# EAGLE design GPS_Shield-v10 (EAGLE 6.2)
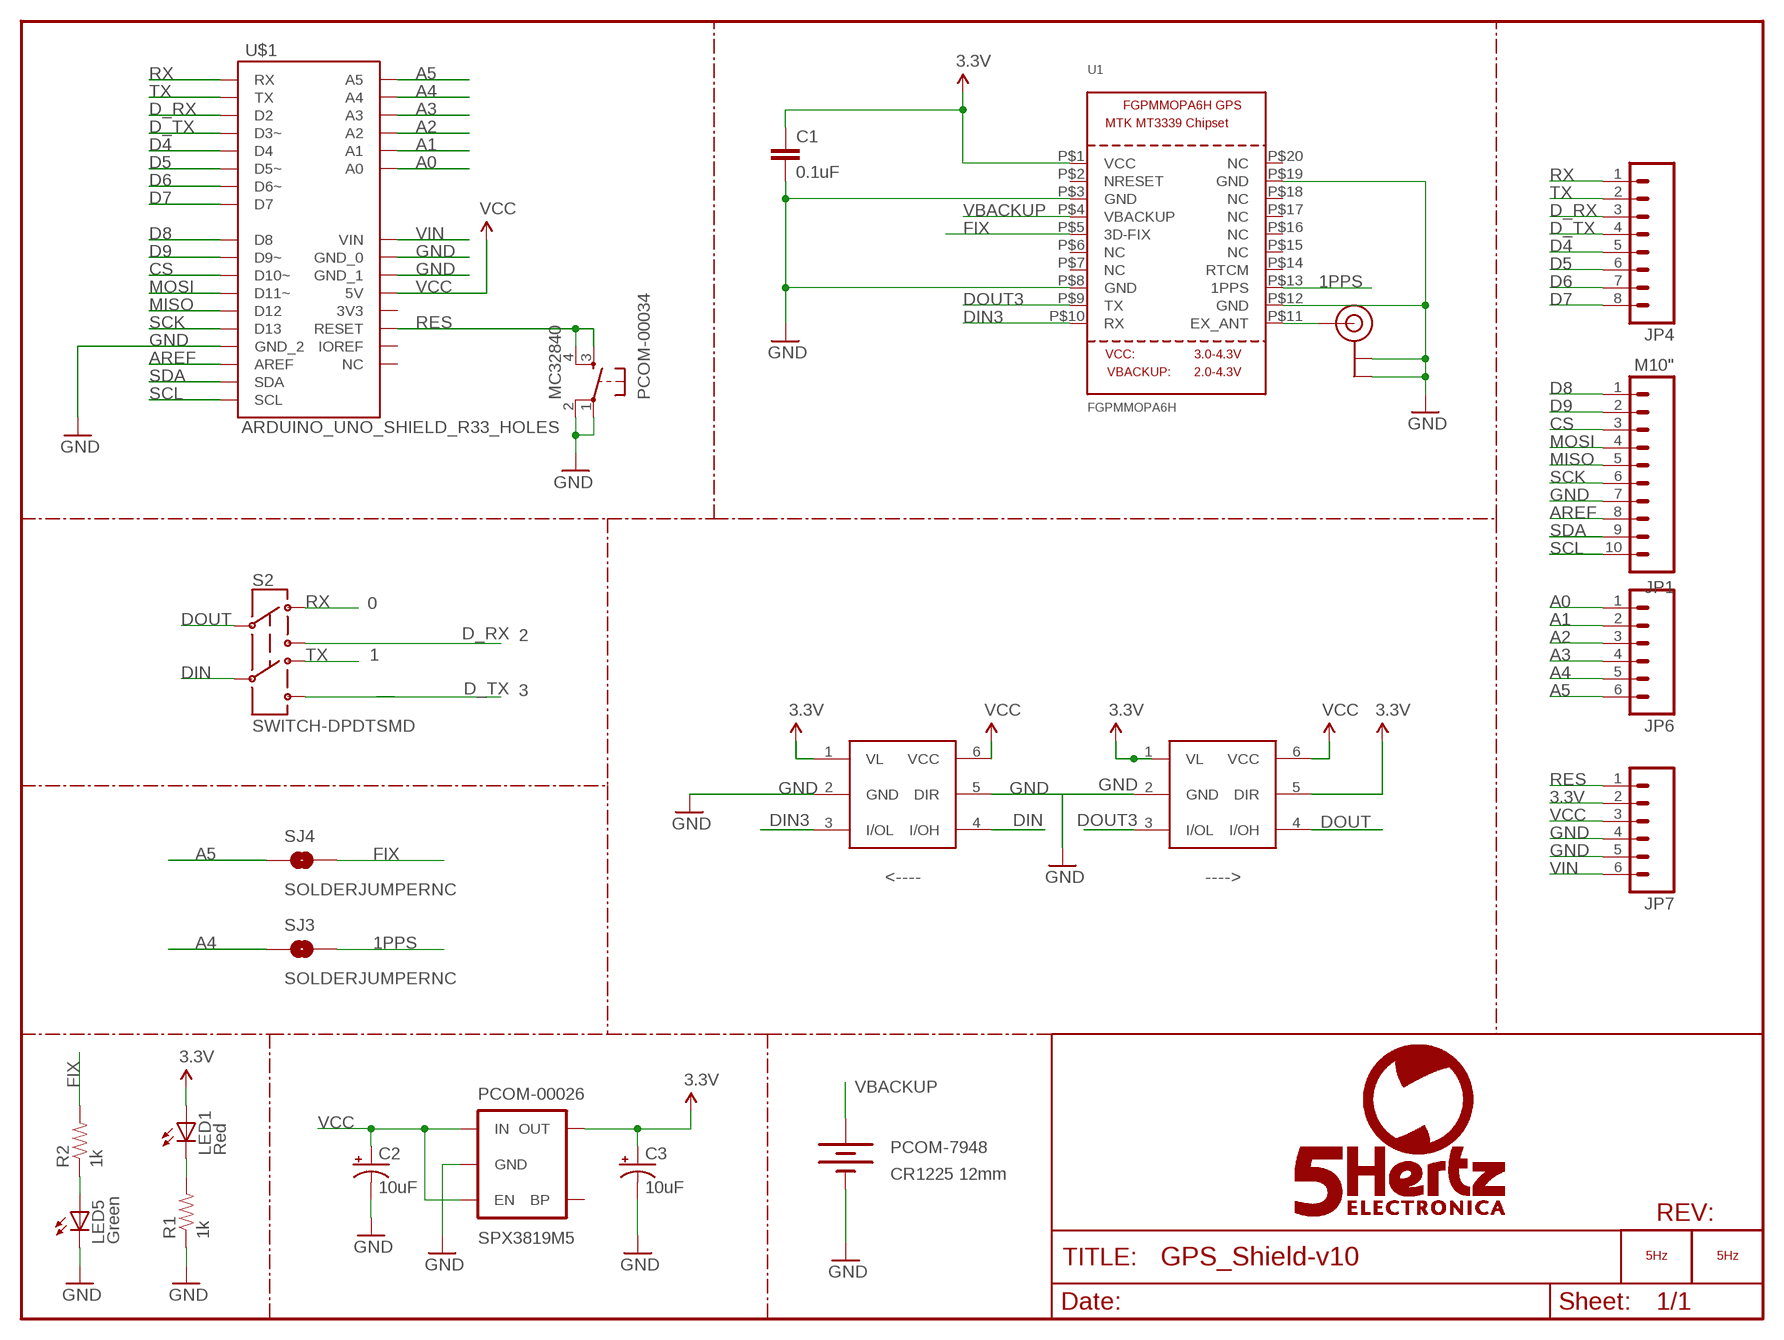
[diagram p0: schematic, sheet 1]

## Parts
C1  0.1uF  CAP0603-CAP  [0603-CAP]
C2  10uF  CAP_POL1206  [EIA3216]
C3  10uF  CAP_POL1206  [EIA3216]
JP1  M10"  [1X10]
JP4  M08  [1X08]
JP6  M06SIP  [1X06]
JP7  M06SIP  [1X06]
LED1  Red  LED0603  [LED-0603]
LED5  Green  LED0603  [LED-0603]
LOGO1  LOGO_5HZ_H_COOPER_15MM  [5HZ_LOGO_H_COOPER_15MM]
LOGO2  LOGO_5HZ_H_20MM  [5HZ_LOGO_H_20MM]
PCOM-00026  SPX3819M5  V_REG_LDOSMD  [SOT23-5]
PCOM-00034  MC32840  TAC_SWITCHSMD  [TACTILE_SWITCH_SMD]
PCOM-7948  CR1225 12mm  BATTERY12PTH  [BATTCON_12MM_PTH]
R1  1k  RESISTOR0603-RES  [0603-RES]
R2  1k  RESISTOR0603-RES  [0603-RES]
S2  SWITCH-DPDTSMD  [AYZ0202]
SJ3  SOLDERJUMPERNC  [SJ_2S]
SJ4  SOLDERJUMPERNC  [SJ_2S]
U1  FGPMMOPA6H  GPS_FGPMMOPA6H  [FGPMMOPA6H]
U$1  ARDUINO_UNO_SHIELD_R33_HOLES  [UNO_R3_SHIELD_3_HOLES_NO_SILK]
U$7  MAX337  [SOT-363]
U$8  MAX337  [SOT-363]
U$20  U.FL  [U.FL]

## Nets
1PPS: SJ3.2 U1.P$13(1PPS)
3.3V: C1.1 C3.A(+) JP7.2 LED1.A PCOM-00026.5(OUT) U1.P$1(VCC) U$7.1(VL) U$8.1(VL) U$8.5(DIR)
A0: JP6.1 U$1.A0
A1: JP6.2 U$1.A1
A2: JP6.3 U$1.A2
A3: JP6.4 U$1.A3
A4: JP6.5 SJ3.1 U$1.A4
A5: JP6.6 SJ4.1 U$1.A5
AREF: JP1.8 U$1.AREF
CS: JP1.3 U$1.D10(D10~)
D4: JP4.5 U$1.D4
D5: JP4.6 U$1.D5(D5~)
D6: JP4.7 U$1.D6(D6~)
D7: JP4.8 U$1.D7
D8: JP1.1 U$1.D8
D9: JP1.2 U$1.D9(D9~)
D_RX: JP4.3 S2.3 U$1.D2
D_TX: JP4.4 S2.6 U$1.D3(D3~)
DIN: S2.5 U$7.4(I/OH)
DIN3: U1.P$10(RX) U$7.3(I/OL)
DOUT: S2.2 U$8.4(I/OH)
DOUT3: U1.P$9(TX) U$8.3(I/OL)
FIX: R2.2 SJ4.2 U1.P$5(3D-FIX)
GND: C1.2 C2.C(-) C3.C(-) JP1.7 JP7.4 JP7.5 LED5.C PCOM-00026.2(GND) PCOM-00034.1 PCOM-00034.2 PCOM-7948.GND(-) R1.1 U1.P$3(GND) U1.P$8(GND) U1.P$12(GND) U1.P$19(GND) U$1.GND_0 U$1.GND_1 U$1.GND_2 U$7.2(GND) U$7.5(DIR) U$8.2(GND) U$20.P$1(GND) U$20.P$2(GND)
MISO: JP1.5 U$1.D12
MOSI: JP1.4 U$1.D11(D11~)
N$6: LED1.C R1.2
N$7: U1.P$11(EX_ANT) U$20.P$3(SIGNAL)
N$139: LED5.A R2.1
RES: JP7.1 PCOM-00034.3 PCOM-00034.4 U$1.RES(RESET)
RX: JP4.1 S2.1 U$1.RX
SCK: JP1.6 U$1.D13
SCL: JP1.10 U$1.SCL
SDA: JP1.9 U$1.SDA
TX: JP4.2 S2.4 U$1.TX
VBACKUP: PCOM-7948.VCC@1(+) U1.P$4(VBACKUP)
VCC: C2.A(+) JP7.3 PCOM-00026.1(IN) PCOM-00026.3(EN) U$1.5V U$7.6(VCC) U$8.6(VCC)
VIN: JP7.6 U$1.VIN
Unconnected: PCOM-00026.4(BP) U1.P$2(NRESET) U1.P$6(NC) U1.P$7(NC) U1.P$14(RTCM) U1.P$15(NC) U1.P$16(NC) U1.P$17(NC) U1.P$18(NC) U1.P$20(NC) U$1.3.3V(3V3) U$1.IOREF U$1.NC

## Notes on the sheet
- 0
- 2
- 1
- 3
- <---- | ---->

## Library data of the parts
C1 = 5hz-electronica:CAP: Capacitor Standard 0603 ceramic capacitor, and 0.1" leaded capacitor.
C2 C3 = SparkFun:CAP_POL: Capacitor Polarized These are standard SMD and PTH capacitors. Normally 10uF, 47uF, and 100uF in electrolytic and tantalum varieties. Always verify the external diameter of the through hole cap, it varies with capacity, voltage, and manufacturer. The EIA devices should be standard.
JP1 = SparkFun:M10: Header 10 Standard 10-pin 0.1" header. Use with straight break away headers (SKU : PRT-00116), right angle break away headers (PRT-00553), swiss pins (PRT-00743), machine pins (PRT-00117), and female headers (PRT-00115).
JP4 = SparkFun:M08: Header 8 Standard 8-pin 0.1" header. Use with straight break away headers (SKU : PRT-00116), right angle break away headers (PRT-00553), swiss pins (PRT-00743), machine pins (PRT-00117), and female headers (PRT-00115).
JP6 JP7 = SparkFun:M06: Header 6 Standard 6-pin 0.1" header. Use with straight break away headers (SKU : PRT-00116), right angle break away headers (PRT-00553), swiss pins (PRT-00743), machine pins (PRT-00117), and female headers (PRT-00115). Molex polarized connector foot print use with SKU : PRT-08094 with associated crimp pins and housings. NOTES ON THE VARIANTS LOCK and LOCK_LONGPADS... This footprint was designed to help hold the alignment of a through-hole component (i.e. 6-pin header) while soldering it into place. You may notice that each hole has been shifted either up or down by 0.005 of an inch from it's more standard position (which is a perfectly straight line). This slight alteration caused the pins (the squares in the middle) to touch the edges of the holes. Because they are alternating, it causes a "brace" to hold the component in place. 0.005 has proven to be the perfect amount of "off-center" position when using our standard breakaway headers. Although looks a little odd when you look at the bare footprint, once you have a header in there, the alteration is very hard to notice. Also, if you push a header all the way into place, it is covered up entirely on the bottom side. This idea of altering the position of holes to aid alignment will be further integrated into the Sparkfun Library for other footprints. It can help hold any component with 3 or more connection pins.
LED1 LED5 = SparkFun:LED: LEDs Standard schematic elements and footprints for 5mm, 3mm, 1206, and 0603 sized LEDs. 5mm - Spark Fun Electronics SKU : COM-00529 (and others)
LOGO1 LOGO2 = 5hz-electronica:LOGO_5HZ: Logotipo 5Hz "según Pedro"
PCOM-00026 = SparkFun:V_REG_LDO: Voltage Regulator LDO Standard 150mA LDO voltage regulator in SOT-23 layout. Micrel part MIC5205. BP (by-pass) pin is used to lower output noise with 470pF cap.
PCOM-00034 = SparkFun:TAC_SWITCH: Momentary Switch Button commonly used for reset or general input. Spark Fun Electronics SKU : COM-00097
PCOM-7948 = SparkFun:BATTERY: Battery Holders Various common sizes : AA, AAA, 20mm coin cell and 12mm coin cell.
R1 R2 = SparkFun:RESISTOR: Resistor Basic schematic elements and footprints for 0603, 1206, and PTH resistors.
S2 = SparkFun:SWITCH-DPDT: DPDT Version of the COM-00597
SJ3 SJ4 = SparkFun:SOLDERJUMPER: Solder Jumper Standard SMD solder jumper. Used to automate production. Two varients : Normally Open and Normally Closed are the same, but have different paste layers. NC will have a large amount of paste and should jumper during reflow.
U1 = microbuilder:GPS_FGPMMOPA6H: GPS Module - MTK MT3339 Chipset, -165dBm sensitivity, 22 channels, 10Hz, auto-select external antenna options
U$1 = 5hz-electronica:ARDUINO_UNO_SHIELD_R3
U$7 U$8 = 74LVCH1T45:MAX337
U$20 = microbuilder:U.FL: U.FL Antenna Connector

## Board
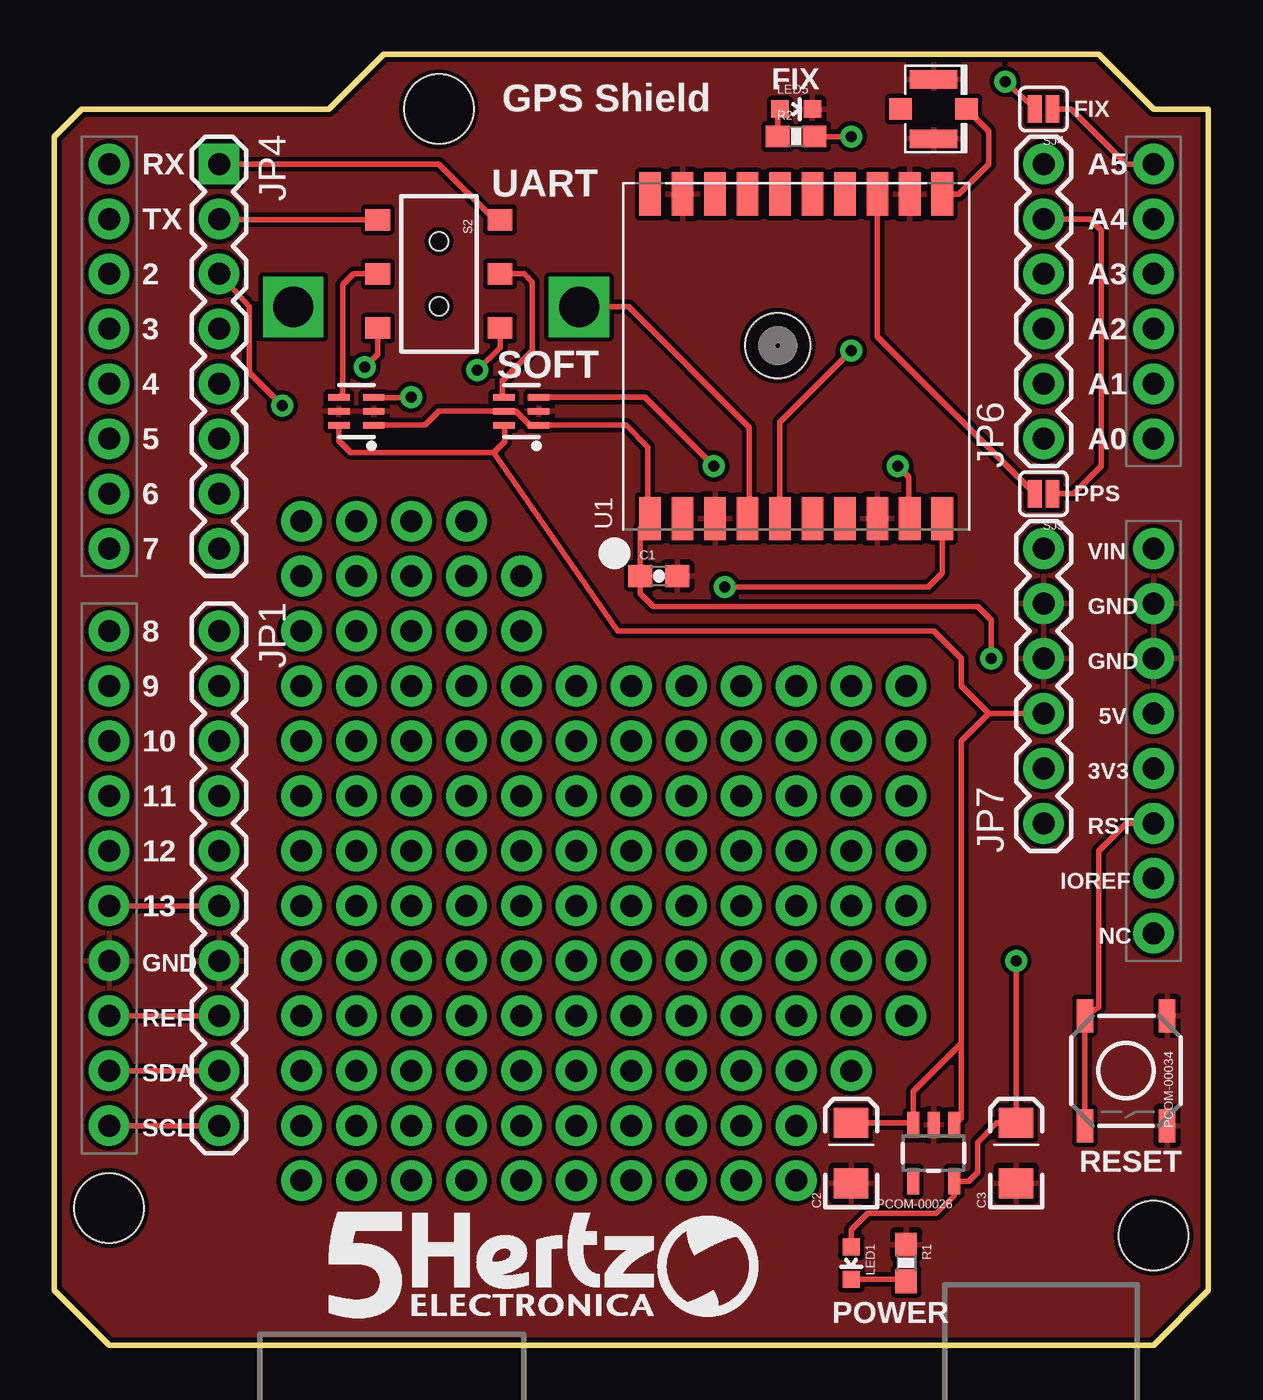
[diagram p1: board, top side]
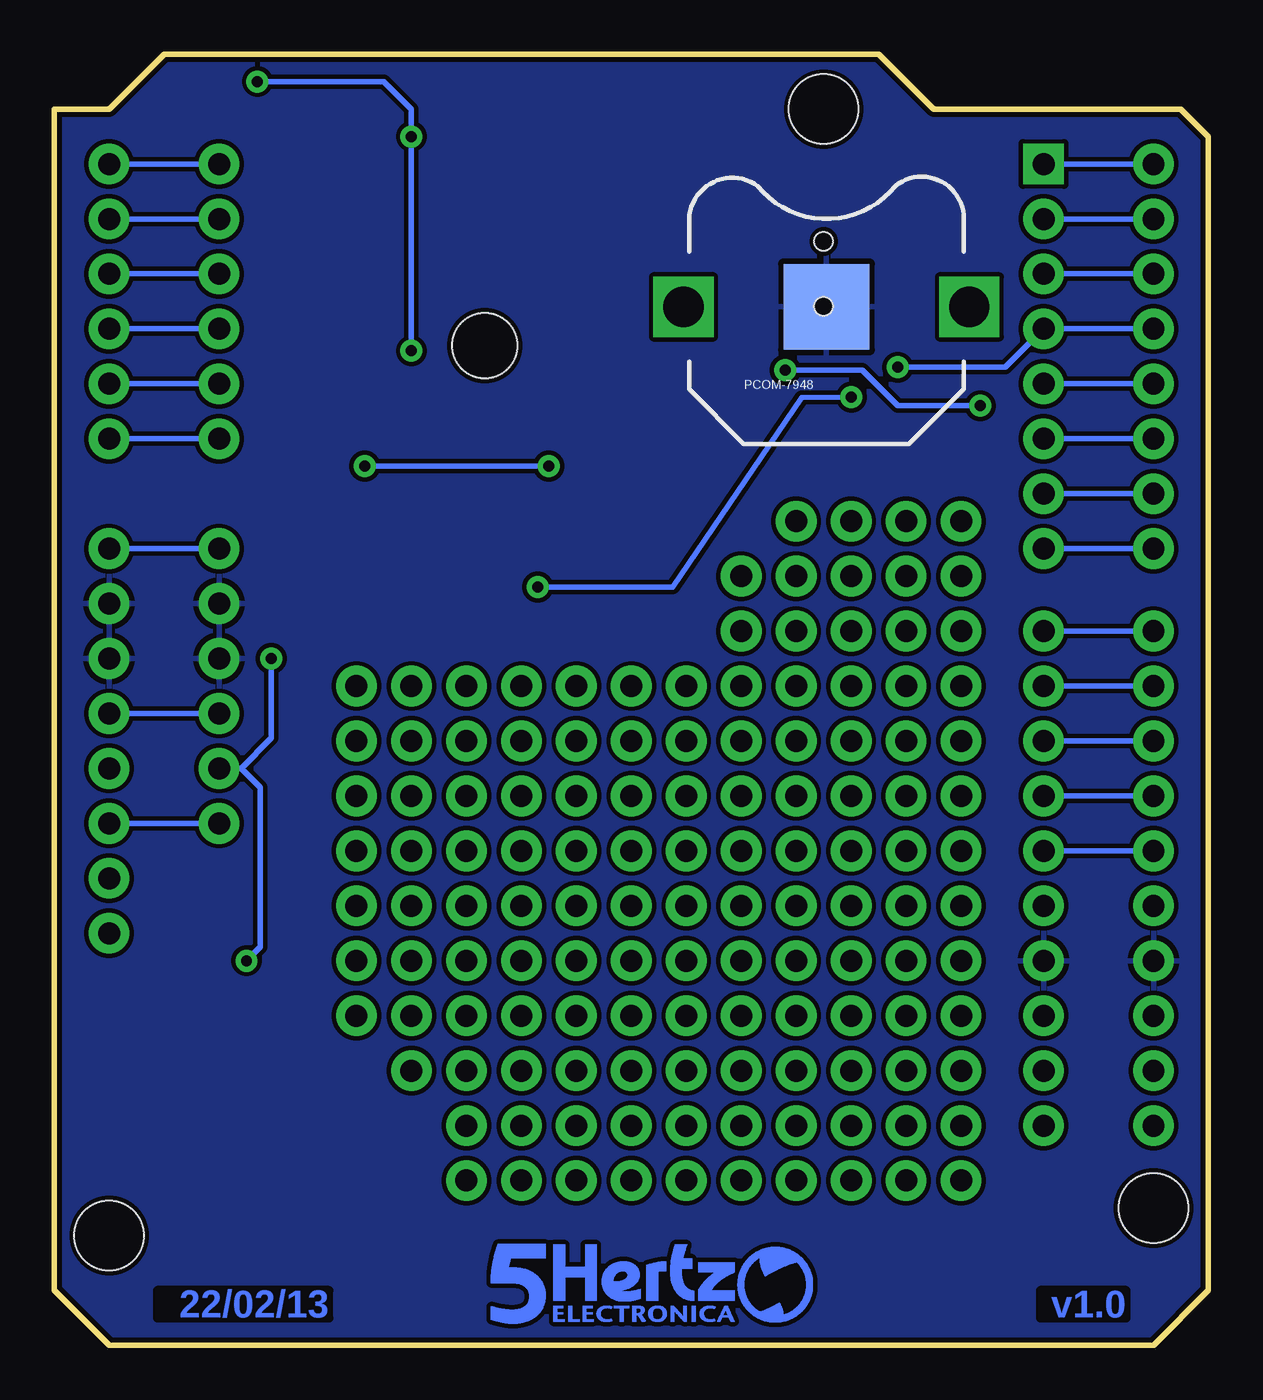
[diagram p2: board, bottom side, seen from below]

Size 53.34 x 59.69 mm. Coordinates in mm from the lower left corner, seen from the top.
Outline: 0,2.54 0,55.88 1.27,57.15 12.7,57.15 15.24,59.69 48.26,59.69 50.8,57.15 53.34,57.15 53.34,2.54 50.8,0 2.54,0 0,2.54
Copper layers (1*16): Top 0.035mm / dielectric 1.5mm / Bottom 0.035mm
Design rules: minimum track width 8mil, minimum drill 20mil, track to track 8mil, track to pad 8mil, pad to pad 8mil, via to via 8mil, smd to smd 8mil, copper to edge 9mil, drill to drill 8mil, minimum pad ring 12mil, minimum via ring 10mil, stop-mask expansion 4mil, vias tented up to drill 20mil, thermal gap 10mil

### Footprints (pad centres in the part's own frame; a part is rotated, then mirrored left to right if it is on the bottom)
0603-CAP = smd 1.1 x 1: 1 -0.85,0; 2 0.85,0
EIA3216 = smd 1.4 x 1.6: A 1.4,0; C -1.4,0
1X10 = drill 1.016 pad 1.88: 1 0,0; 2 2.54,0; 3 5.08,0; 4 7.62,0; 5 10.16,0; 6 12.7,0; 7 15.24,0; 8 17.78,0; 9 20.32,0; 10 22.86,0
1X08 = drill 1.016 pad 1.88 square: 1 0,0 | drill 1.016 pad 1.88: 2 2.54,0; 3 5.08,0; 4 7.62,0; 5 10.16,0; 6 12.7,0; 7 15.24,0; 8 17.78,0
1X06 = drill 1.016 pad 1.88: 1 0,0; 2 2.54,0; 3 5.08,0; 4 7.62,0; 5 10.16,0; 6 12.7,0
LED-0603 = smd 0.8 x 0.8: A 0,-0.75; C 0,0.75
SOT23-5 = smd 0.55 x 1.2: 1 -0.95,-1.3; 2 0,-1.3; 3 0.95,-1.3; 4 0.95,1.3; 5 -0.95,1.3
TACTILE_SWITCH_SMD = smd 1.524 x 0.762: 1 -2.54,1.905; 2 2.54,1.905; 3 -2.54,-1.905; 4 2.54,-1.905
BATTCON_12MM_PTH = smd 3.962 x 3.962: GND 0,0 | drill 1.854 square: VCC@1 -6.604,0; VCC@2 6.604,0
0603-RES = smd 1.1 x 1: 1 -0.85,0; 2 0.85,0
AYZ0202 = smd 1 x 1.15: 1 -2.5,2.825; 2 0,2.825; 3 2.5,2.825; 4 -2.5,-2.825; 5 0,-2.825; 6 2.5,-2.825 | hole 0.85: 1.5,0; -1.5,0
SJ_2S = smd 0.635 x 1.27: 1 -0.412,0; 2 0.412,0
FGPMMOPA6H = smd 2 x 1: P$1 -7.5,6.75; P$2 -7.5,5.25; P$3 -7.5,3.75; P$4 -7.5,2.25; P$5 -7.5,0.75; P$6 -7.5,-0.75; P$7 -7.5,-2.25; P$8 -7.5,-3.75; P$9 -7.5,-5.25; P$10 -7.5,-6.75; P$11 7.5,-6.75; P$12 7.5,-5.25; P$13 7.5,-3.75; P$14 7.5,-2.25; P$15 7.5,-0.75; P$16 7.5,0.75; P$17 7.5,2.25; P$18 7.5,3.75; P$19 7.5,5.25; P$20 7.5,6.75 | hole 3: 0.5,0.85
UNO_R3_SHIELD_3_HOLES_NO_SILK = drill 1.016 pad 1.88: 3.3V 26.67,2.54; 5V 29.21,2.54; A0 41.91,2.54; A1 44.45,2.54; A2 46.99,2.54; A3 49.53,2.54; A4 52.07,2.54; A5 54.61,2.54; AREF 15.24,50.8; D2 49.53,50.8; D3 46.99,50.8; D4 44.45,50.8; D5 41.91,50.8; D6 39.37,50.8; D7 36.83,50.8; D8 33.02,50.8; D9 30.48,50.8; D10 27.94,50.8; D11 25.4,50.8; D12 22.86,50.8; D13 20.32,50.8; GND_0 34.29,2.54; GND_1 31.75,2.54; GND_2 17.78,50.8; IOREF 21.59,2.54; NC 19.05,2.54; RES 24.13,2.54; RX 54.61,50.8; SCL 10.16,50.8; SDA 12.7,50.8; TX 52.07,50.8; VIN 36.83,2.54 | hole 3.2: 6.35,50.8; 5.08,2.54; 57.15,35.56
SOT-363 = smd 0.3 x 0.99: 1 -0.65,-0.8; 2 0,-0.8; 3 0.65,-0.8; 4 0.65,0.81; 5 0,0.81; 6 -0.65,0.81
U.FL = smd 2.2 x 0.85: P$1 0,1.375; P$2 0,-1.375 | smd 1.05 x 1: P$3 1.525,0; P$4 -1.525,0

### Placement (x,y rotation side)
C1  27.94,35.56 0 top
C2  36.83,8.89 90 top
C3  44.45,8.89 90 top
JP1  7.62,33.02 270 top
JP4  7.62,54.61 270 top
JP6  45.72,41.91 90 top
JP7  45.72,24.13 90 top
LED1  36.83,3.81 180 top
LED5  34.29,57.15 270 top
LOGO1  33.15,1.02 0 bottom
LOGO2  12.7,1.27 0 top
PCOM-00026  40.64,8.89 180 top
PCOM-00034  49.53,12.7 270 top
PCOM-7948  17.65,48.01 0 bottom
R1  39.37,3.81 270 top
R2  34.29,55.88 0 top
S2  17.78,49.53 270 top
SJ3  45.72,39.37 180 top
SJ4  45.72,57.15 180 top
U1  34.29,45.72 90 top
U$1  53.34,0 90 top
U$7  13.97,43.18 90 top
U$8  21.59,43.18 90 top
U$20  40.64,57.15 0 top

### Tracks (layer width: path | path; a pad name or v marks a point on that pad's centre or on a via)
1PPS
  Top 0.254: U1.P$13 38.04,46.64 SJ3.2
3.3V  (via drill 0.51)
  Top 0.254: LED1.A 36.83,5.33 37.59,6.1 40.77,6.1 41.59,6.92 PCOM-00026.5 42.26,7.59 42.67,8 42.67,9.4 43.56,10.29 C3.A v44.45,17.78 | v43.31,31.75 43.31,33.53 42.67,34.16 27.69,34.16 27.09,34.76 C1.1 27.09,37.77 U1.P$1 27.43,38.33 27.43,41.53 26.43,42.53 U$8.1 21.99,42.53 21.34,43.18 U$8.5 17.78,43.18 17.13,42.53 U$7.1
  Bottom 0.254: JP7.2 44.7,26.67 | 44.7,26.67 43.82,25.78 43.82,18.41 v44.45,17.78 | v43.31,31.75 43.31,28.07 44.7,26.67
A0
  Bottom 0.254: JP6.1 U$1.A0
A1
  Bottom 0.254: JP6.2 U$1.A1
A2
  Bottom 0.254: JP6.3 U$1.A2
A3
  Bottom 0.254: JP6.4 U$1.A3
A4
  Top 0.254: SJ3.1 47.12,39.37 48.39,40.64 48.39,51.56 47.88,52.07 JP6.5
  Bottom 0.254: JP6.5 U$1.A4
A5
  Top 0.254: SJ4.1 46.99,57.15 49.53,54.61 U$1.A5
  Bottom 0.254: U$1.A5 JP6.6
AREF
  Top 0.254: U$1.AREF JP1.8
CS
  Bottom 0.254: U$1.D10 JP1.3
D4
  Bottom 0.254: U$1.D4 JP4.5
D5
  Bottom 0.254: U$1.D5 JP4.6
D6
  Bottom 0.254: U$1.D6 JP4.7
D7
  Bottom 0.254: U$1.D7 JP4.8
D8
  Bottom 0.254: U$1.D8 JP1.1
D9
  Bottom 0.254: U$1.D9 JP1.2
D_RX  (via drill 0.51)
  Top 0.254: S2.3 20.61,46.13 v19.56,45.09 | v10.54,43.43 9.02,44.96 9.02,48.01 JP4.3
  Bottom 0.254: U$1.D2 JP4.3 | v19.56,45.09 16,45.09 14.35,43.43 v10.54,43.43
D_TX  (via drill 0.51)
  Top 0.254: S2.6 14.96,45.82 v14.35,45.21
  Bottom 0.254: v14.35,45.21 9.4,45.21 JP4.4 U$1.D3
DIN
  Top 0.254: S2.5 13.84,49.53 13.33,49.02 13.33,44.01 U$7.4
DIN3  (via drill 0.51)
  Top 0.254: U1.P$10 41.04,35.71 40.39,35.05 v30.99,35.05 | U$7.3 14.79,43.81 16.51,43.81 v16.5,43.83
  Bottom 0.254: v30.99,35.05 24.77,35.05 18.8,43.81 16.78,43.83 v16.5,43.83
DOUT
  Top 0.254: S2.2 21.72,49.53 22.1,49.15 22.1,45.97 20.7,44.58 20.7,43.91 U$8.4
DOUT3  (via drill 0.51)
  Top 0.254: U$8.3 27.29,43.83 v30.48,40.64 | v38.99,40.64 39.5,40.13 39.5,38.26 U1.P$9
  Bottom 0.254: v30.48,40.64 v38.99,40.64
FIX  (via drill 0.51)
  Top 0.254: R2.2 v36.83,55.88 | U1.P$5 33.53,38.23 33.53,42.67 v36.83,45.97 | SJ4.2 45.31,57.18 v43.94,58.42
  Bottom 0.254: v36.83,45.97 v36.83,55.88 36.83,57.15 38.1,58.42 v43.94,58.42
GND
  pour Bottom: 2.54,0 0,2.54 0,55.88 1.27,57.15 12.7,57.15 15.24,59.69 48.26,59.69 50.8,57.15 53.34,57.15 53.34,2.54 50.8,0
  pour Top: 2.54,0 0,2.54 0,55.88 1.27,57.15 12.7,57.15 15.24,59.69 48.26,59.69 50.8,57.15 53.34,57.15 53.34,2.54 50.8,0
MISO
  Bottom 0.254: U$1.D12 JP1.5
MOSI
  Bottom 0.254: U$1.D11 JP1.4
N$1  (via drill 1.02 pad 1.88)
  other vias: 26.67,30.48
N$2  (via drill 1.02 pad 1.88)
  other vias: 11.43,25.4
N$3  (via drill 1.02 pad 1.88)
  other vias: 24.13,30.48
N$4  (via drill 1.02 pad 1.88)
  other vias: 11.43,22.86
N$5  (via drill 1.02 pad 1.88)
  other vias: 21.59,30.48
N$6
  Top 0.254: R1.2 39.37,3.17 39.26,3.06 LED1.C
N$7
  Top 0.254: U1.P$11 41.79,53.22 43.18,54.61 43.18,56.13 U$20.P$3
N$8  (via drill 1.02 pad 1.88)
  other vias: 21.59,22.86
N$9  (via drill 1.02 pad 1.88)
  other vias: 16.51,30.48
N$10  (via drill 1.02 pad 1.88)
  other vias: 16.51,27.94
N$11  (via drill 1.02 pad 1.88)
  other vias: 16.51,25.4
N$12  (via drill 1.02 pad 1.88)
  other vias: 16.51,22.86
N$13  (via drill 1.02 pad 1.88)
  other vias: 16.51,20.32
N$14  (via drill 1.02 pad 1.88)
  other vias: 19.05,20.32
N$15  (via drill 1.02 pad 1.88)
  other vias: 21.59,20.32
N$16  (via drill 1.02 pad 1.88)
  other vias: 24.13,20.32
N$17  (via drill 1.02 pad 1.88)
  other vias: 26.67,20.32
N$18  (via drill 1.02 pad 1.88)
  other vias: 29.21,20.32
N$19  (via drill 1.02 pad 1.88)
  other vias: 31.75,20.32
N$20  (via drill 1.02 pad 1.88)
  other vias: 34.29,20.32
N$21  (via drill 1.02 pad 1.88)
  other vias: 36.83,20.32
N$22  (via drill 1.02 pad 1.88)
  other vias: 36.83,22.86
N$23  (via drill 1.02 pad 1.88)
  other vias: 36.83,25.4
N$24  (via drill 1.02 pad 1.88)
  other vias: 36.83,27.94
N$25  (via drill 1.02 pad 1.88)
  other vias: 36.83,30.48
N$26  (via drill 1.02 pad 1.88)
  other vias: 39.37,30.48
N$27  (via drill 1.02 pad 1.88)
  other vias: 39.37,27.94
N$28  (via drill 1.02 pad 1.88)
  other vias: 39.37,25.4
N$29  (via drill 1.02 pad 1.88)
  other vias: 39.37,22.86
N$30  (via drill 1.02 pad 1.88)
  other vias: 13.97,30.48
N$31  (via drill 1.02 pad 1.88)
  other vias: 13.97,27.94
N$32  (via drill 1.02 pad 1.88)
  other vias: 13.97,25.4
N$33  (via drill 1.02 pad 1.88)
  other vias: 13.97,22.86
N$34  (via drill 1.02 pad 1.88)
  other vias: 13.97,20.32
N$35  (via drill 1.02 pad 1.88)
  other vias: 13.97,33.02
N$36  (via drill 1.02 pad 1.88)
  other vias: 16.51,33.02
N$37  (via drill 1.02 pad 1.88)
  other vias: 19.05,33.02
N$38  (via drill 1.02 pad 1.88)
  other vias: 21.59,33.02
N$39  (via drill 1.02 pad 1.88)
  other vias: 11.43,33.02
N$40  (via drill 1.02 pad 1.88)
  other vias: 11.43,30.48
N$41  (via drill 1.02 pad 1.88)
  other vias: 11.43,27.94
N$42  (via drill 1.02 pad 1.88)
  other vias: 11.43,35.56
N$43  (via drill 1.02 pad 1.88)
  other vias: 13.97,35.56
N$44  (via drill 1.02 pad 1.88)
  other vias: 16.51,35.56
N$45  (via drill 1.02 pad 1.88)
  other vias: 19.05,35.56
N$46  (via drill 1.02 pad 1.88)
  other vias: 11.43,38.1
N$47  (via drill 1.02 pad 1.88)
  other vias: 13.97,38.1
N$48  (via drill 1.02 pad 1.88)
  other vias: 16.51,38.1
N$49  (via drill 1.02 pad 1.88)
  other vias: 19.05,38.1
N$50  (via drill 1.02 pad 1.88)
  other vias: 21.59,35.56
N$51  (via drill 1.02 pad 1.88)
  other vias: 11.43,20.32
N$52  (via drill 1.02 pad 1.88)
  other vias: 11.43,17.78
N$53  (via drill 1.02 pad 1.88)
  other vias: 13.97,17.78
N$54  (via drill 1.02 pad 1.88)
  other vias: 16.51,17.78
N$55  (via drill 1.02 pad 1.88)
  other vias: 19.05,17.78
N$56  (via drill 1.02 pad 1.88)
  other vias: 21.59,17.78
N$57  (via drill 1.02 pad 1.88)
  other vias: 24.13,17.78
N$58  (via drill 1.02 pad 1.88)
  other vias: 26.67,17.78
N$59  (via drill 1.02 pad 1.88)
  other vias: 29.21,17.78
N$60  (via drill 1.02 pad 1.88)
  other vias: 31.75,17.78
N$61  (via drill 1.02 pad 1.88)
  other vias: 34.29,17.78
N$62  (via drill 1.02 pad 1.88)
  other vias: 36.83,17.78
N$63  (via drill 1.02 pad 1.88)
  other vias: 39.37,20.32
N$64  (via drill 1.02 pad 1.88)
  other vias: 39.37,17.78
N$65  (via drill 1.02 pad 1.88)
  other vias: 39.37,15.24
N$66  (via drill 1.02 pad 1.88)
  other vias: 36.83,15.24
N$67  (via drill 1.02 pad 1.88)
  other vias: 34.29,15.24
N$68  (via drill 1.02 pad 1.88)
  other vias: 31.75,15.24
N$69  (via drill 1.02 pad 1.88)
  other vias: 29.21,15.24
N$70  (via drill 1.02 pad 1.88)
  other vias: 26.67,15.24
N$71  (via drill 1.02 pad 1.88)
  other vias: 24.13,15.24
N$72  (via drill 1.02 pad 1.88)
  other vias: 21.59,15.24
N$73  (via drill 1.02 pad 1.88)
  other vias: 19.05,15.24
N$74  (via drill 1.02 pad 1.88)
  other vias: 16.51,15.24
N$75  (via drill 1.02 pad 1.88)
  other vias: 13.97,15.24
N$76  (via drill 1.02 pad 1.88)
  other vias: 11.43,15.24
N$77  (via drill 1.02 pad 1.88)
  other vias: 11.43,12.7
N$78  (via drill 1.02 pad 1.88)
  other vias: 13.97,12.7
N$79  (via drill 1.02 pad 1.88)
  other vias: 16.51,12.7
N$80  (via drill 1.02 pad 1.88)
  other vias: 19.05,12.7
N$81  (via drill 1.02 pad 1.88)
  other vias: 21.59,12.7
N$82  (via drill 1.02 pad 1.88)
  other vias: 24.13,12.7
N$83  (via drill 1.02 pad 1.88)
  other vias: 26.67,12.7
N$84  (via drill 1.02 pad 1.88)
  other vias: 29.21,12.7
N$85  (via drill 1.02 pad 1.88)
  other vias: 31.75,12.7
N$86  (via drill 1.02 pad 1.88)
  other vias: 34.29,12.7
N$87  (via drill 1.02 pad 1.88)
  other vias: 36.83,12.7
N$88  (via drill 1.02 pad 1.88)
  other vias: 34.29,10.16
N$89  (via drill 1.02 pad 1.88)
  other vias: 31.75,10.16
N$90  (via drill 1.02 pad 1.88)
  other vias: 29.21,10.16
N$91  (via drill 1.02 pad 1.88)
  other vias: 26.67,10.16
N$92  (via drill 1.02 pad 1.88)
  other vias: 24.13,10.16
N$93  (via drill 1.02 pad 1.88)
  other vias: 21.59,10.16
N$94  (via drill 1.02 pad 1.88)
  other vias: 19.05,10.16
N$95  (via drill 1.02 pad 1.88)
  other vias: 16.51,10.16
N$96  (via drill 1.02 pad 1.88)
  other vias: 13.97,10.16
N$97  (via drill 1.02 pad 1.88)
  other vias: 11.43,10.16
N$98  (via drill 1.02 pad 1.88)
  other vias: 11.43,7.62
N$99  (via drill 1.02 pad 1.88)
  other vias: 13.97,7.62
N$100  (via drill 1.02 pad 1.88)
  other vias: 16.51,7.62
N$101  (via drill 1.02 pad 1.88)
  other vias: 19.05,7.62
N$102  (via drill 1.02 pad 1.88)
  other vias: 21.59,7.62
N$103  (via drill 1.02 pad 1.88)
  other vias: 24.13,7.62
N$104  (via drill 1.02 pad 1.88)
  other vias: 26.67,7.62
N$105  (via drill 1.02 pad 1.88)
  other vias: 29.21,7.62
N$106  (via drill 1.02 pad 1.88)
  other vias: 31.75,7.62
N$107  (via drill 1.02 pad 1.88)
  other vias: 34.29,7.62
N$115  (via drill 1.02 pad 1.88)
  other vias: 34.29,30.48
N$116  (via drill 1.02 pad 1.88)
  other vias: 31.75,30.48
N$117  (via drill 1.02 pad 1.88)
  other vias: 29.21,30.48
N$121  (via drill 1.02 pad 1.88)
  other vias: 19.05,30.48
N$126  (via drill 1.02 pad 1.88)
  other vias: 19.05,27.94
N$127  (via drill 1.02 pad 1.88)
  other vias: 21.59,27.94
N$128  (via drill 1.02 pad 1.88)
  other vias: 24.13,27.94
N$129  (via drill 1.02 pad 1.88)
  other vias: 26.67,27.94
N$130  (via drill 1.02 pad 1.88)
  other vias: 29.21,27.94
N$131  (via drill 1.02 pad 1.88)
  other vias: 31.75,27.94
N$132  (via drill 1.02 pad 1.88)
  other vias: 34.29,27.94
N$139
  Top 0.254: R2.1 33.44,57.05 LED5.A
N$141  (via drill 1.02 pad 1.88)
  other vias: 34.29,25.4
N$142  (via drill 1.02 pad 1.88)
  other vias: 31.75,25.4
N$143  (via drill 1.02 pad 1.88)
  other vias: 29.21,25.4
N$144  (via drill 1.02 pad 1.88)
  other vias: 26.67,25.4
N$145  (via drill 1.02 pad 1.88)
  other vias: 24.13,25.4
N$146  (via drill 1.02 pad 1.88)
  other vias: 21.59,25.4
N$147  (via drill 1.02 pad 1.88)
  other vias: 19.05,25.4
N$152  (via drill 1.02 pad 1.88)
  other vias: 19.05,22.86
N$154  (via drill 1.02 pad 1.88)
  other vias: 24.13,22.86
N$155  (via drill 1.02 pad 1.88)
  other vias: 26.67,22.86
N$156  (via drill 1.02 pad 1.88)
  other vias: 29.21,22.86
N$157  (via drill 1.02 pad 1.88)
  other vias: 31.75,22.86
N$158  (via drill 1.02 pad 1.88)
  other vias: 34.29,22.86
RES
  Top 0.254: U$1.RES 49.53,24.13 48.26,22.86 48.26,15.62 PCOM-00034.3 PCOM-00034.4
  Bottom 0.254: U$1.RES JP7.1
RX
  Top 0.254: S2.1 20.36,52.03 17.78,54.61 JP4.1
  Bottom 0.254: 6.35,54.61 JP4.1 U$1.RX
SCK
  Top 0.254: U$1.D13 JP1.6
SCL
  Top 0.254: U$1.SCL JP1.10
SDA
  Top 0.254: U$1.SDA JP1.9
TX
  Top 0.254: S2.4 7.66,52.03 JP4.2
  Bottom 0.254: U$1.TX JP4.2
VBACKUP
  Top 0.254: PCOM-7948.VCC@1 26.54,48.01 32.13,42.42 32.13,38.31 U1.P$4
VCC
  Top 0.254: 41.91,13.97 41.91,10.51 PCOM-00026.1 | C2.A 39.59,10.29 PCOM-00026.3 39.69,11.75 41.91,13.97 | JP7.3 43.18,29.21 | 41.91,13.97 41.91,27.94 43.18,29.21 | U$7.6 13.16,41.83 13.72,41.27 20.32,41.27 | U$8.6 20.83,42.48 20.83,41.78 20.32,41.27 | 43.18,29.21 41.91,30.48 41.91,31.75 40.64,33.02 26.04,33.02 20.32,41.27
  Bottom 0.254: JP7.3 U$1.5V
VIN
  Bottom 0.254: JP7.6 U$1.VIN

### Text on the board
Bottom: v1.0 | 22/02/13
tPlace: FIX | GPS Shield | FIX | RX | A5 | UART | TX | A4 | 2 | A3 | 3 | A2 | SOFT | 4 | A1 | 5 | A0 | 6 | PPS | 7 | VIN | GND | 8 | GND | 9 | 5V | 10 | 3V3 | 11 | RST | 12 | IOREF | 13 | NC | GND | REF | SDA | SCL | RESET | POWER